# EAGLE schematic BpodFSM_r2_5 (EAGLE 9.6.2)
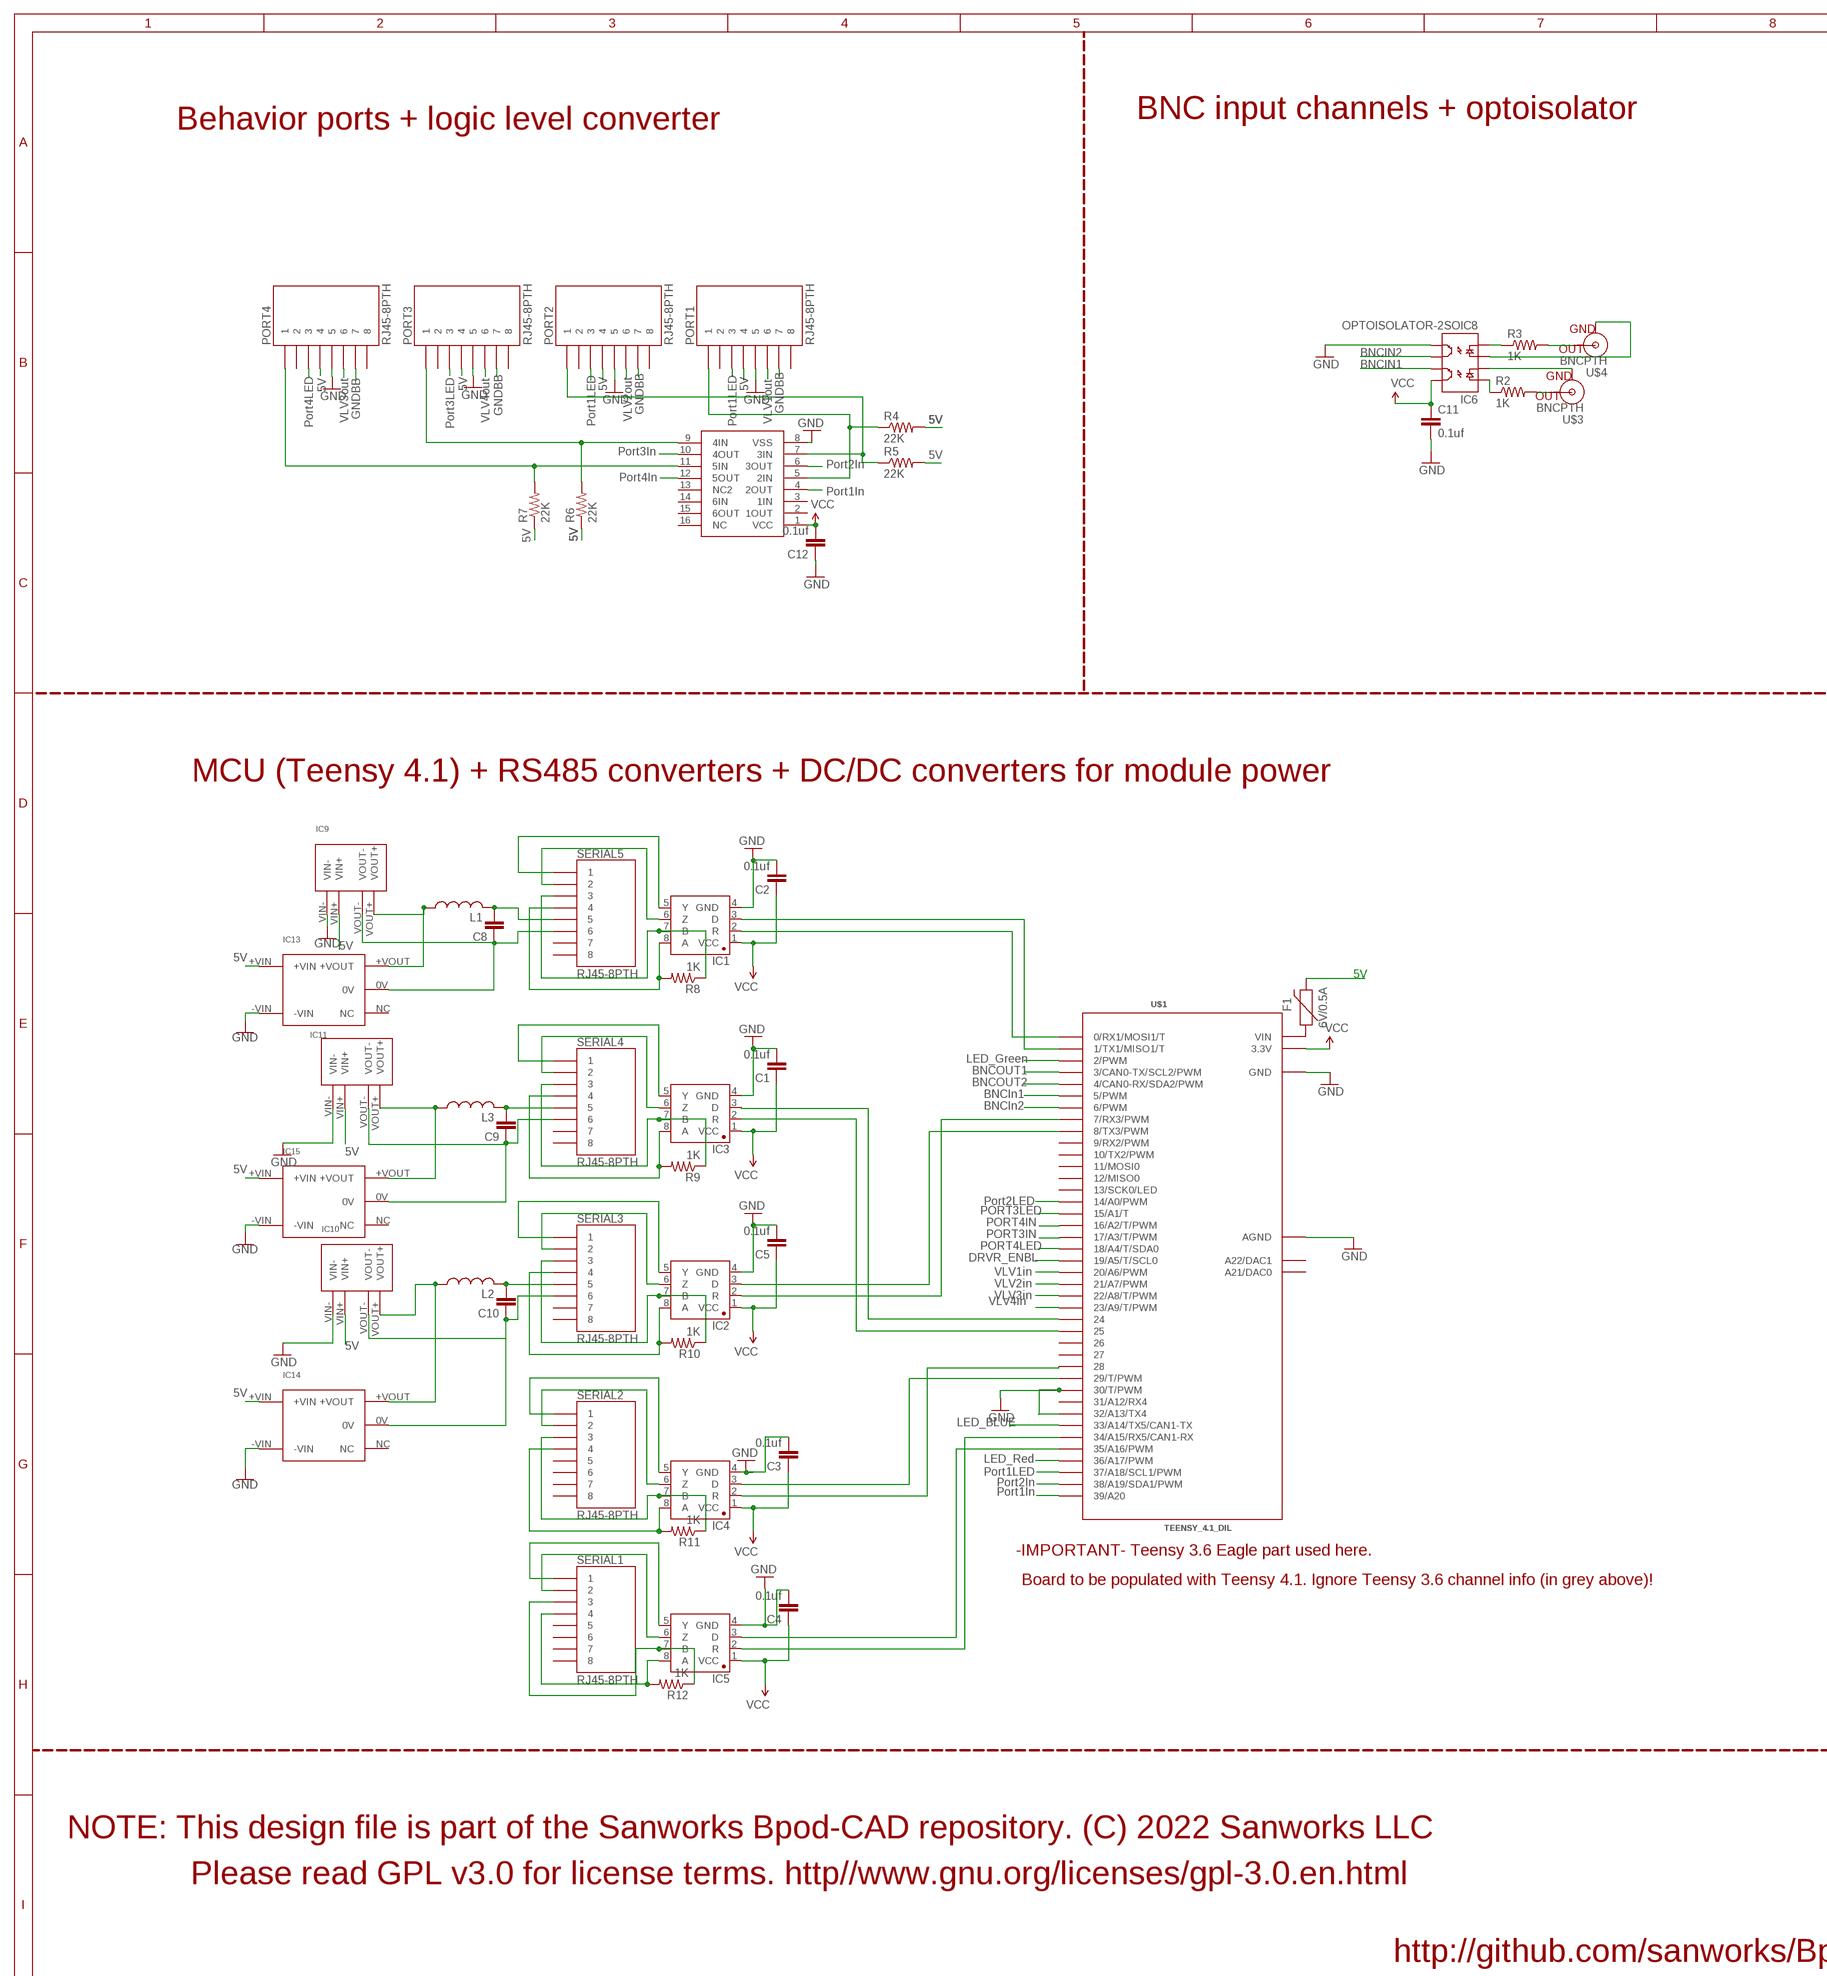
[diagram p0: schematic, sheet 1, part 1 of 2]
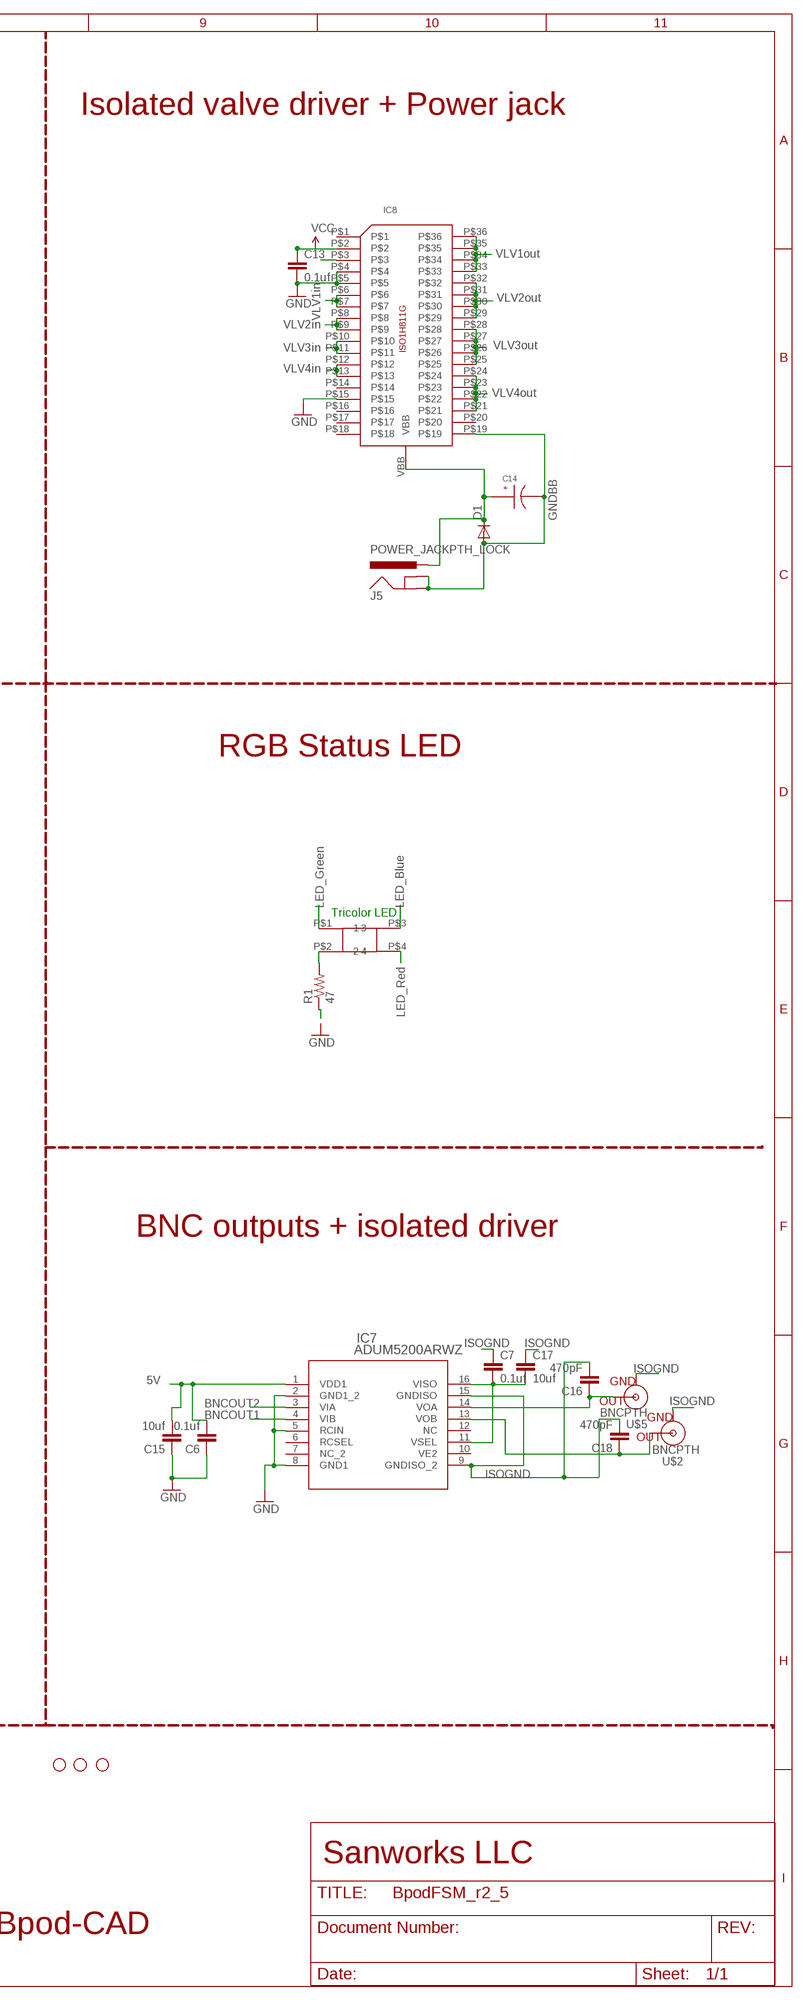
[diagram p1: schematic, sheet 1, part 2 of 2]

## Parts
C1  0.1uf  CAP1206  [1206@1]
C2  0.1uf  CAP1206  [1206@1]
C3  0.1uf  CAP1206  [1206@1]
C4  0.1uf  CAP1206  [1206@1]
C5  0.1uf  CAP1206  [1206@1]
C6  0.1uf  1.0UF-0805-25V-10%  [0805]
C7  0.1uf  1.0UF-0805-25V-10%  [0805]
C8  CAP1206  [1206@1]
C9  CAP1206  [1206@1]
C10  CAP1206  [1206@1]
C11  0.1uf  CAP1206  [1206@1]
C12  0.1uf  CAP1206  [1206@1]
C13  0.1uf  CAP1206  [1206@1]
C14  EEE-FK1H100UR  [EEE-FK1H100UR]
C15  10uf  CAP1206  [1206@1]
C16  470pF  1.0UF-0805-25V-10%  [0805]
C17  10uf  CAP1206  [1206@1]
C18  470pF  1.0UF-0805-25V-10%  [0805]
D1  DIODE-DO214AA  [DO214AA]
F1  6V/0.5A  PPTC_HALF-AMP  [1206]
IC1  SN65HVD31DR  [SO08]
IC2  SN65HVD31DR  [SO08]
IC3  SN65HVD31DR  [SO08]
IC4  SN65HVD31DR  [SO08]
IC5  SN65HVD31DR  [SO08]
IC6  OPTOISOLATOR-2SOIC8  [SO08-2]
IC7  ADUM5200ARWZ  [RW_16]
IC8  ISO1H811G  [ISO1H811G]
IC9  NME0509SC  [NME0509SC]
IC10  NME0509SC  [NME0509SC]
IC11  NME0509SC  [NME0509SC]
IC12  CD4050  [SO16]
IC13  MTU1D0505MC  [MTU1D0505MC]
IC14  MTU1D0505MC  [MTU1D0505MC]
IC15  MTU1D0505MC  [MTU1D0505MC]
J5  POWER_JACKPTH_LOCK  [POWER_JACK_PTH_LOCK]
JP3  STAND-OFF  [STAND-OFF]
JP4  STAND-OFF  [STAND-OFF]
JP5  STAND-OFF  [STAND-OFF]
L1  L-USL3225M  [L3225M]
L2  L-USL3225M  [L3225M]
L3  L-USL3225M  [L3225M]
PORT1  RJ45-8PTH  [RJ45-8]
PORT2  RJ45-8PTH  [RJ45-8]
PORT3  RJ45-8PTH  [RJ45-8]
PORT4  RJ45-8PTH  [RJ45-8]
R1  47  RESISTOR1206  [1206]
R2  1K  RESISTOR1206  [1206]
R3  1K  RESISTOR1206  [1206]
R4  22K  RESISTOR1206  [1206]
R5  22K  RESISTOR1206  [1206]
R6  22K  RESISTOR1206  [1206]
R7  22K  RESISTOR1206  [1206]
R8  1K  RESISTOR1206  [1206]
R9  1K  RESISTOR1206  [1206]
R10  1K  RESISTOR1206  [1206]
R11  1K  RESISTOR1206  [1206]
R12  1K  RESISTOR1206  [1206]
SERIAL1  RJ45-8PTH  [RJ45-8]
SERIAL2  RJ45-8PTH  [RJ45-8]
SERIAL3  RJ45-8PTH  [RJ45-8]
SERIAL4  RJ45-8PTH  [RJ45-8]
SERIAL5  RJ45-8PTH  [RJ45-8]
U$1  TEENSY_4.1_DIL  TEENSY_3.6_DIL  [TEENSY_3.6_DIL]
U$2  BNCPTH  [BNC]
U$3  BNCPTH  [BNC]
U$4  BNCPTH  [BNC]
U$5  BNCPTH  [BNC]
U$8  SQUARE_TRICOLOR_LED  [SQUARE_TRICOLOR_LED]

## Nets
5V: C6.2 C15.2 F1.2 IC7.1(VDD1) IC9.VIN+ IC10.VIN+ IC11.VIN+ IC13.+VIN IC14.+VIN IC15.+VIN PORT1.4 PORT2.4 PORT3.4 PORT4.4 R4.2 R5.2 R6.1 R7.1
BNCIN1: IC6.7(EM1) U$1.6(6/PWM)
BNCIN2: IC6.6(CL2) U$1.5(5/PWM)
BNCOUT1: IC7.4(VIB) U$1.4(4/CAN0-RX/SDA2/PWM)
BNCOUT2: IC7.3(VIA) U$1.3(3/CAN0-TX/SCL2/PWM)
DRVR_ENBL: IC8.P$3 U$1.19/A5(19/A5/T/SCL0)
GND: C1.2 C2.2 C3.2 C4.2 C5.2 C6.1 C11.2 C12.1 C13.2 C15.1 IC1.4(GND) IC2.4(GND) IC3.4(GND) IC4.4(GND) IC5.4(GND) IC6.5(EM2) IC7.2(GND1_2) IC7.5(RCIN) IC7.8(GND1) IC8.P$4 IC8.P$5 IC8.P$15 IC9.VIN- IC10.VIN- IC11.VIN- IC12.8(VSS) IC13.-VIN IC14.-VIN IC15.-VIN PORT1.5 PORT2.5 PORT3.5 PORT4.5 R1.1 U$1.30(30/T/PWM) U$1.32/A13(32/A13/TX4) U$1.AGND U$1.GND U$1.GND1(GND)
GNDBB: C14.CATHODE D1.A IC8.P$19 J5.GND J5.GNDBREAK PORT1.7 PORT2.7 PORT3.7 PORT4.7
ISOGND: C7.1 C16.2 C17.1 C18.2 IC7.9(GNDISO_2) IC7.15(GNDISO) U$2.GND U$5.GND
LED_BLUE: U$1.33/A14(33/A14/TX5/CAN1-TX) U$8.P$3
LED_GREEN: U$1.2(2/PWM) U$8.P$1
LED_RED: U$1.36/A17(36/A17/PWM) U$8.P$4
N$1: IC3.8(A) R9.2 SERIAL4.4
N$2: IC3.7(B) R9.1 SERIAL4.3
N$3: IC3.6(Z) SERIAL4.2
N$4: IC3.5(Y) SERIAL4.1
N$5: IC3.2(R) U$1.25
N$6: IC3.3(D) U$1.24
N$7: IC1.8(A) R8.2 SERIAL5.4
N$8: IC1.7(B) R8.1 SERIAL5.3
N$9: IC1.6(Z) SERIAL5.2
N$10: IC1.5(Y) SERIAL5.1
N$11: IC1.2(R) U$1.0(0/RX1/MOSI1/T)
N$12: IC1.3(D) U$1.1(1/TX1/MISO1/T)
N$13: IC6.3(A2) U$4.GND
N$14: R3.2 U$4.S(OUT)
N$15: R2.2 U$3.S(OUT)
N$16: IC6.2(C1) U$3.GND
N$17: IC2.8(A) R10.2 SERIAL3.4
N$18: IC2.7(B) R10.1 SERIAL3.3
N$19: IC2.6(Z) SERIAL3.2
N$20: IC12.7(3IN) PORT2.1 R5.1
N$21: IC2.5(Y) SERIAL3.1
N$22: IC2.2(R) U$1.7(7/RX3/PWM)
N$23: C8.2 L1.2 SERIAL5.5
N$24: IC12.9(4IN) PORT3.1 R6.2
N$25: R1.2 U$8.P$2
N$26: C8.1 IC9.VOUT- IC13.0V SERIAL5.6
N$27: C18.1 IC7.13(VOB) U$2.S(OUT)
N$28: IC2.3(D) U$1.8(8/TX3/PWM)
N$29: F1.1 U$1.VIN
N$30: IC4.2(R) U$1.28
N$31: IC12.11(5IN) PORT4.1 R7.2
N$32: IC5.8(A) R12.2 SERIAL1.4
N$33: IC5.7(B) R12.1 SERIAL1.3
N$34: IC5.6(Z) SERIAL1.2
N$35: IC5.5(Y) SERIAL1.1
N$36: IC4.8(A) R11.2 SERIAL2.4
N$37: IC4.7(B) R11.1 SERIAL2.3
N$38: IC4.6(Z) SERIAL2.2
N$39: IC9.VOUT+ IC13.+VOUT L1.1
N$40: IC4.5(Y) SERIAL2.1
N$41: IC11.VOUT+ IC15.+VOUT L3.1
N$42: IC5.2(R) U$1.34/A15(34/A15/RX5/CAN1-RX)
N$43: C10.1 IC10.VOUT- IC14.0V SERIAL3.6
N$44: C10.2 L2.2 SERIAL3.5
N$45: IC10.VOUT+ IC14.+VOUT L2.1
N$46: C7.2 C17.2 IC7.11(VSEL) IC7.16(VISO)
N$47: C9.1 IC11.VOUT- IC15.0V SERIAL4.6
N$48: IC5.3(D) U$1.35/A16(35/A16/PWM)
N$49: C9.2 L3.2 SERIAL4.5
N$50: C16.1 IC7.14(VOA) U$5.S(OUT)
N$51: IC4.3(D) U$1.29(29/T/PWM)
N$54: IC6.1(A1) R2.1
N$55: IC6.4(C2) R3.1
N$56: IC12.5(2IN) PORT1.1 R4.1
PORT1IN: IC12.4(2OUT) U$1.39/A20
PORT1LED: PORT1.3 U$1.37/A18(37/A18/SCL1/PWM)
PORT2IN: IC12.6(3OUT) U$1.38/A19(38/A19/SDA1/PWM)
PORT2LED: PORT2.3 U$1.14/A0(14/A0/PWM)
PORT3IN: IC12.10(4OUT) U$1.17/A3(17/A3/T/PWM)
PORT3LED: PORT3.3 U$1.15/A1(15/A1/T)
PORT4IN: IC12.12(5OUT) U$1.16/A2(16/A2/T/PWM)
PORT4LED: PORT4.3 U$1.18/A4(18/A4/T/SDA0)
VBB: C14.ANODE D1.C IC8.VBB J5.PWR
VCC: C1.1 C2.1 C3.1 C4.1 C5.1 C11.1 C12.2 C13.1 IC1.1(VCC) IC2.1(VCC) IC3.1(VCC) IC4.1(VCC) IC5.1(VCC) IC6.8(CL1) IC8.P$2 IC12.1(VCC) U$1.3.3V U$1.3.3V3(3.3V)
VLV1IN: IC8.P$6 IC8.P$7 U$1.23/A9(23/A9/T/PWM)
VLV1OUT: IC8.P$33 IC8.P$34 IC8.P$35 IC8.P$36 PORT1.6
VLV2IN: IC8.P$8 IC8.P$9 U$1.22/A8(22/A8/T/PWM)
VLV2OUT: IC8.P$29 IC8.P$30 IC8.P$31 IC8.P$32 PORT2.6
VLV3IN: IC8.P$12 IC8.P$13 U$1.20/A6(20/A6/PWM)
VLV3OUT: IC8.P$21 IC8.P$22 IC8.P$23 IC8.P$24 PORT3.6
VLV4IN: IC8.P$10 IC8.P$11 U$1.21/A7(21/A7/PWM)
VLV4OUT: IC8.P$25 IC8.P$26 IC8.P$27 IC8.P$28 PORT4.6
Unconnected: IC7.6(RCSEL) IC7.7(NC_2) IC7.10(VE2) IC7.12(NC) IC8.P$1 IC8.P$14 IC8.P$16 IC8.P$17 IC8.P$18 IC8.P$20 IC12.2(1OUT) IC12.3(1IN) IC12.13(NC2) IC12.14(6IN) IC12.15(6OUT) IC12.16(NC) IC13.NC IC14.NC IC15.NC PORT1.2 PORT1.8 PORT2.2 PORT2.8 PORT3.2 PORT3.8 PORT4.2 PORT4.8 SERIAL1.5 SERIAL1.6 SERIAL1.7 SERIAL1.8 SERIAL2.5 SERIAL2.6 SERIAL2.7 SERIAL2.8 SERIAL3.7 SERIAL3.8 SERIAL4.7 SERIAL4.8 SERIAL5.7 SERIAL5.8 U$1.9(9/RX2/PWM) U$1.10(10/TX2/PWM) U$1.11(11/MOSI0) U$1.12(12/MISO0) U$1.13(13/SCK0/LED) U$1.26 U$1.27 U$1.31/A12(31/A12/RX4) U$1.A21(A21/DAC0) U$1.A22(A22/DAC1)

## Notes on the sheet
- BNC input channels + optoisolator | Isolated valve driver + Power jack
- Behavior ports + logic level converter
- VLV1out
- VLV2out
- VLV1in
- VLV2in
- BNCIN2 | VLV3in | VLV3out
- BNCIN1
- VLV4in
- 5V | 5V | 5V | 5V
- VLV4out
- GNDBB | GNDBB | GNDBB
- GNDBB | VLV2out
- VLV3out | VLV4out | VLV1out | 5V
- Port4LED | Port3LED | Port1LED | Port1LED
- Port3In
- 5V
- Port2In
- Port4In
- GNDBB
- Port1In
- 5V | 5V
- RGB Status LED
- MCU (Teensy 4.1) + RS485 converters + DC/DC converters for module power
- LED_Green
- LED_Blue
- Tricolor LED
- 5V | LED_Red
- LED_Green
- BNCOUT1
- BNCOUT2
- BNCIn1
- BNCIn2
- Port2LED
- BNC outputs + isolated driver
- DRVR_ENBL
- VLV1in
- VLV2in
- VLV3in
- VLV4in
- LED_Red
- Port1LED
- Port2In
- Port1In
- -IMPORTANT- Teensy 3.6 Eagle part used here.
- Board to be populated with Teensy 4.1. Ignore Teensy 3.6 channel info (in grey above)!
- NOTE: This design file is part of the Sanworks Bpod-CAD repository. (C) 2022 Sanworks LLC
- Please read GPL v3.0 for license terms. http//www.gnu.org/licenses/gpl-3.0.en.html | Sanworks LLC
- http://github.com/sanworks/Bpod-CAD

## Library data of the parts
C1-C5 C8-C13 C15 C17 = SparkFun-Capacitors:CAP: Capacitor Standard 0603 ceramic capacitor, and 0.1" leaded capacitor.
C6 C7 C16 C18 = SparkFun-Capacitors:1.0UF: 1µF ceramic capacitors A capacitor is a passive two-terminal electrical component used to store electrical energy temporarily in an electric field.; PROD_ID: CAP-08064; VALUE: 1.0uF
C14 = JoshParts10:EEE-FK1H100UR
D1 = diode:DIODE-: DIODE
F1 = SparkFun-Fuses:PPTC: Resettable Fuse PPTC Resettable Fuse. Really a sort of resistor with a polymeric positive temperature coefficient whose resistance increases dramatically with an increase in temperature. When heated by the power passing through the resistance rises causing the current to be limited, protecting the circuit. This is achieved by the transition of the polymer from a crystalline to an amorphous state where the conductive carbon separates breaking the conductive pathways found in the cool crystalline structure. When a PPTC cools back down it resumes conducting letting the circuit turn back on. SparkFun Products: SparkFun RedBoard - Programmed with Arduino <https://www.sparkfun.com/products/12757> Pro Micro - 5V/16MHz <https://www.sparkfun.com/products/12640> Arduino Pro 328 - 5V/16MHz <https://www.sparkfun.com/products/10915> MP3 Trigger <https://www.sparkfun.com/products/13720>; PROD_ID: RES-08585
IC1-IC5 = Joshparts4:SN65HVD31DR: A placeholder for generic narrow & wide SOIC8 foorptints - used on the DIP adapter board.
IC6 = SparkFun-DiscreteSemi:OPTOISOLATOR-2: Description: Dual gate opto isolator. Vishay part : ILD213T; PROD_ID: IC-09076
IC7 = ADUM5200:ADUM5200ARWZ
IC8 = JoshParts10:ISO1H811G
IC9-IC11 = JoshParts10:NME0509SC
IC12 = SparkFun-DigitalIC:CD4050
IC13-IC15 = JoshParts10:MTU1D0505MC
J5 = SparkFun-Connectors:POWER_JACK: Power Jack Connector This is the standard 5.5mm barrel jack for power. The PTH is the most common, proven, reliable, footprint. The Slot footprint only works if the mill layer is transmitted to the PCB fab house so be warned. Here are the connectors we sell at SparkFun: DC Barrel Power Jack/Connector <https://www.sparkfun.com/products/119> (PRT-00119) DC Barrel Power Jack/Connector (SMD) <https://www.sparkfun.com/products/12748> (PRT-12748) DC Barrel Jack Adapter - Breadboard Compatible <https://www.sparkfun.com/products/10811> (PRT-10811) It is used on this SparkFun product (and many, many others): SparkFun RedBoard - Programmed with Arduino <https://www.sparkfun.com/products/12757> (DEV-12757) Also, if you need a mating power supply or connector, please check these out: Wall Adapter Power Supply - 9VDC 650mA <https://www.sparkfun.com/products/298> (TOL-00298) DC Barrel Jack Adapter - Male <https://www.sparkfun.com/products/10287> (PRT-10287); PROD_ID: CONN-08197; SF_ID: PRT-00119
JP3-JP5 = SparkFun:STAND-OFF: Stand Off This is the mechanical footprint for a #4 phillips button head screw. Use the keepout ring to avoid running the screw head into surrounding components. SKU : PRT-00447
L1-L3 = rcl:L-US: INDUCTOR, American symbol
PORT1-PORT4 SERIAL1-SERIAL5 = SparkFun:RJ45-8: RJ45 Jack Simple RJ45, 8-pin connection - connector for common Cat5, Cat5e, and Cat6 Ethernet cables. Footprint not yet proven in production. Connector sku is PRT-00643; Breakout PCB sku is BOB-00716.
R1 = SparkFun-Passives:RESISTOR: Resistor Basic schematic elements and footprints for 0603, 1206, and PTH resistors.
R2-R12 = SparkFun-Resistors:RESISTOR: Resistor Basic schematic elements and footprints for 0603, 1206, and PTH resistors.
U$1 = Teensy_3_and_LC_Series_Boards_v1.4:TEENSY_3.6_DIL: Teensy 3.6 DIL Package
U$2-U$5 = SparkFun:BNC: BNC Connector, Mouser Part# 5227161
U$8 = JoshParts:SQUARE_TRICOLOR_LED

## Net classes
0 default: width 0.254 mm, clearance 0.254 mm